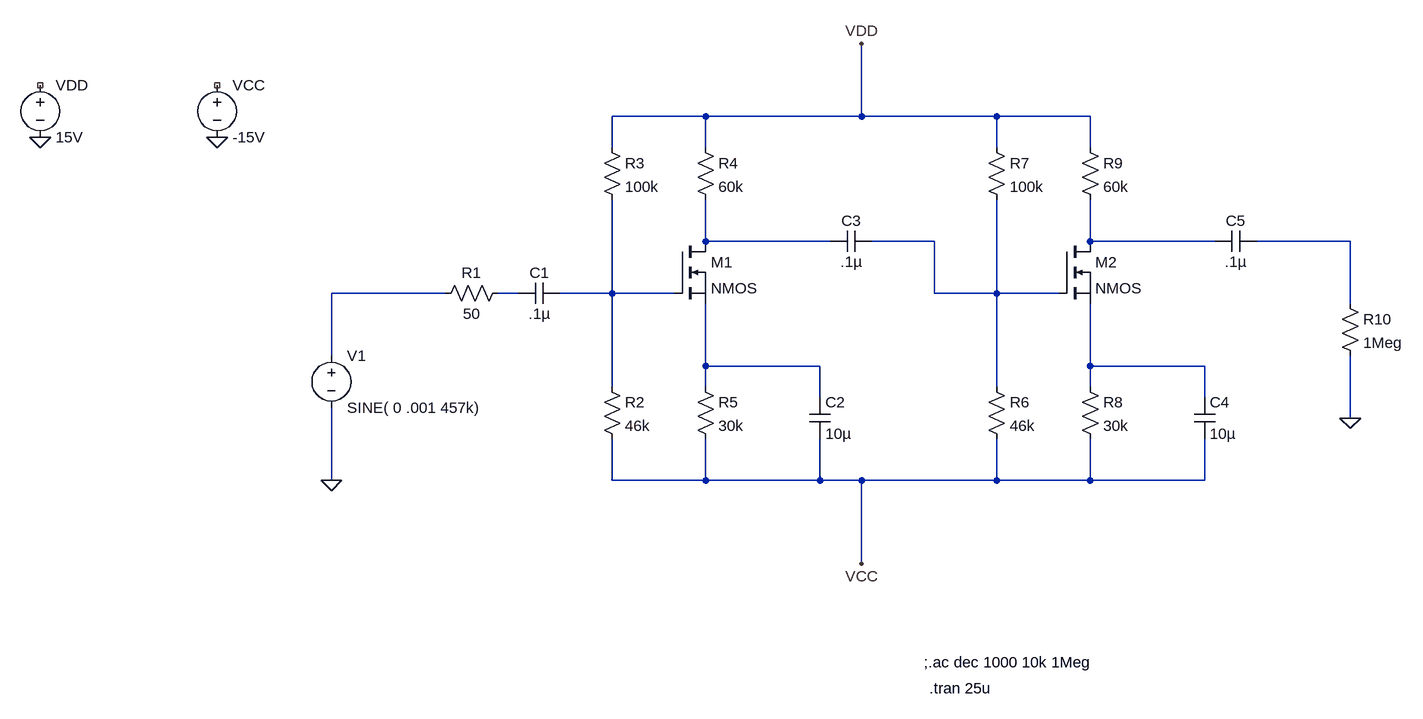
[diagram p0: schematic Discrete_VCA_NMOS.asc]
Discrete_VCA_NMOS.asc, the LTspice schematic file:
Version 4
SHEET 1 1316 1040
WIRE 240 144 96 144
WIRE 480 144 480 32
WIRE 480 144 240 144
WIRE 688 144 480 144
WIRE 832 144 688 144
WIRE 96 192 96 144
WIRE 240 192 240 144
WIRE 688 192 688 144
WIRE 832 192 832 144
WIRE 240 336 240 272
WIRE 432 336 240 336
WIRE 592 336 496 336
WIRE 832 336 832 272
WIRE 1024 336 832 336
WIRE 1232 336 1088 336
WIRE -160 416 -336 416
WIRE -48 416 -80 416
WIRE 96 416 96 272
WIRE 96 416 16 416
WIRE 192 416 96 416
WIRE 592 416 592 336
WIRE 688 416 688 272
WIRE 688 416 592 416
WIRE 784 416 688 416
WIRE 1232 432 1232 336
WIRE -336 512 -336 416
WIRE 240 528 240 432
WIRE 416 528 240 528
WIRE 832 528 832 432
WIRE 1008 528 832 528
WIRE 96 560 96 416
WIRE 240 560 240 528
WIRE 688 560 688 416
WIRE 832 560 832 528
WIRE 416 576 416 528
WIRE 1008 576 1008 528
WIRE 1232 608 1232 512
WIRE -336 704 -336 592
WIRE 96 704 96 640
WIRE 240 704 240 640
WIRE 240 704 96 704
WIRE 416 704 416 640
WIRE 416 704 240 704
WIRE 480 704 416 704
WIRE 688 704 688 640
WIRE 688 704 480 704
WIRE 832 704 832 640
WIRE 832 704 688 704
WIRE 1008 704 1008 640
WIRE 1008 704 832 704
WIRE 480 832 480 704
FLAG -336 704 0
FLAG 1232 608 0
FLAG -784 176 0
FLAG -512 176 0
FLAG 480 832 VCC
FLAG 480 32 VDD
SYMBOL nmos 192 336 R0
SYMATTR InstName M1
SYMBOL Res -64 400 R90
WINDOW 0 0 56 VBottom 2
WINDOW 3 32 56 VTop 2
SYMATTR InstName R1
SYMATTR Value 50
SYMBOL Cap 16 400 R90
WINDOW 0 0 32 VBottom 2
WINDOW 3 32 32 VTop 2
SYMATTR InstName C1
SYMATTR Value .1µ
SYMBOL Res 80 544 R0
SYMATTR InstName R2
SYMATTR Value 46k
SYMBOL Res 80 176 R0
SYMATTR InstName R3
SYMATTR Value 100k
SYMBOL Res 224 544 R0
SYMATTR InstName R5
SYMATTR Value 30k
SYMBOL Cap 400 576 R0
SYMATTR InstName C2
SYMATTR Value 10µ
SYMBOL Cap 496 320 R90
WINDOW 0 0 32 VBottom 2
WINDOW 3 32 32 VTop 2
SYMATTR InstName C3
SYMATTR Value .1µ
SYMBOL Res 224 176 R0
SYMATTR InstName R4
SYMATTR Value 60k
SYMBOL Voltage -336 496 R0
SYMATTR InstName V1
SYMATTR Value SINE( 0 .001 457k)
SYMBOL nmos 784 336 R0
SYMATTR InstName M2
SYMBOL Res 672 544 R0
SYMATTR InstName R6
SYMATTR Value 46k
SYMBOL Res 672 176 R0
SYMATTR InstName R7
SYMATTR Value 100k
SYMBOL Res 816 544 R0
SYMATTR InstName R8
SYMATTR Value 30k
SYMBOL Cap 992 576 R0
SYMATTR InstName C4
SYMATTR Value 10µ
SYMBOL Cap 1088 320 R90
WINDOW 0 0 32 VBottom 2
WINDOW 3 32 32 VTop 2
SYMATTR InstName C5
SYMATTR Value .1µ
SYMBOL Res 816 176 R0
SYMATTR InstName R9
SYMATTR Value 60k
SYMBOL Res 1216 416 R0
SYMATTR InstName R10
SYMATTR Value 1Meg
SYMBOL Voltage -512 80 R0
SYMATTR InstName VCC
SYMATTR Value -15V
SYMBOL Voltage -784 80 R0
SYMATTR InstName VDD
SYMATTR Value 15V
TEXT 576 984 Left 2 !;.ac dec 1000 10k 1Meg
TEXT 584 1024 Left 2 !.tran 25u

The netlist it stands for:
* Discrete_VCA_NMOS.asc
M1 N001 N007 N008 N008 NMOS
R1 N006 N005 50
C1 N007 N006 .1µ
R2 N007 VCC 46k
R3 VDD N007 100k
R5 N008 VCC 30k
C2 N008 VCC 10µ
C3 N002 N001 .1µ
R4 VDD N001 60k
V1 N005 0 SINE( 0 .001 457k)
M2 N003 N002 N009 N009 NMOS
R6 N002 VCC 46k
R7 VDD N002 100k
R8 N009 VCC 30k
C4 N009 VCC 10µ
C5 N004 N003 .1µ
R9 VDD N003 60k
R10 N004 0 1Meg
VCC NC_01 0 -15V
VDD NC_02 0 15V
.model NMOS NMOS
.model PMOS PMOS
.lib standard.mos
;.ac dec 1000 10k 1Meg
.tran 25u
.backanno
.end